# Altium project MCU.PrjPcb
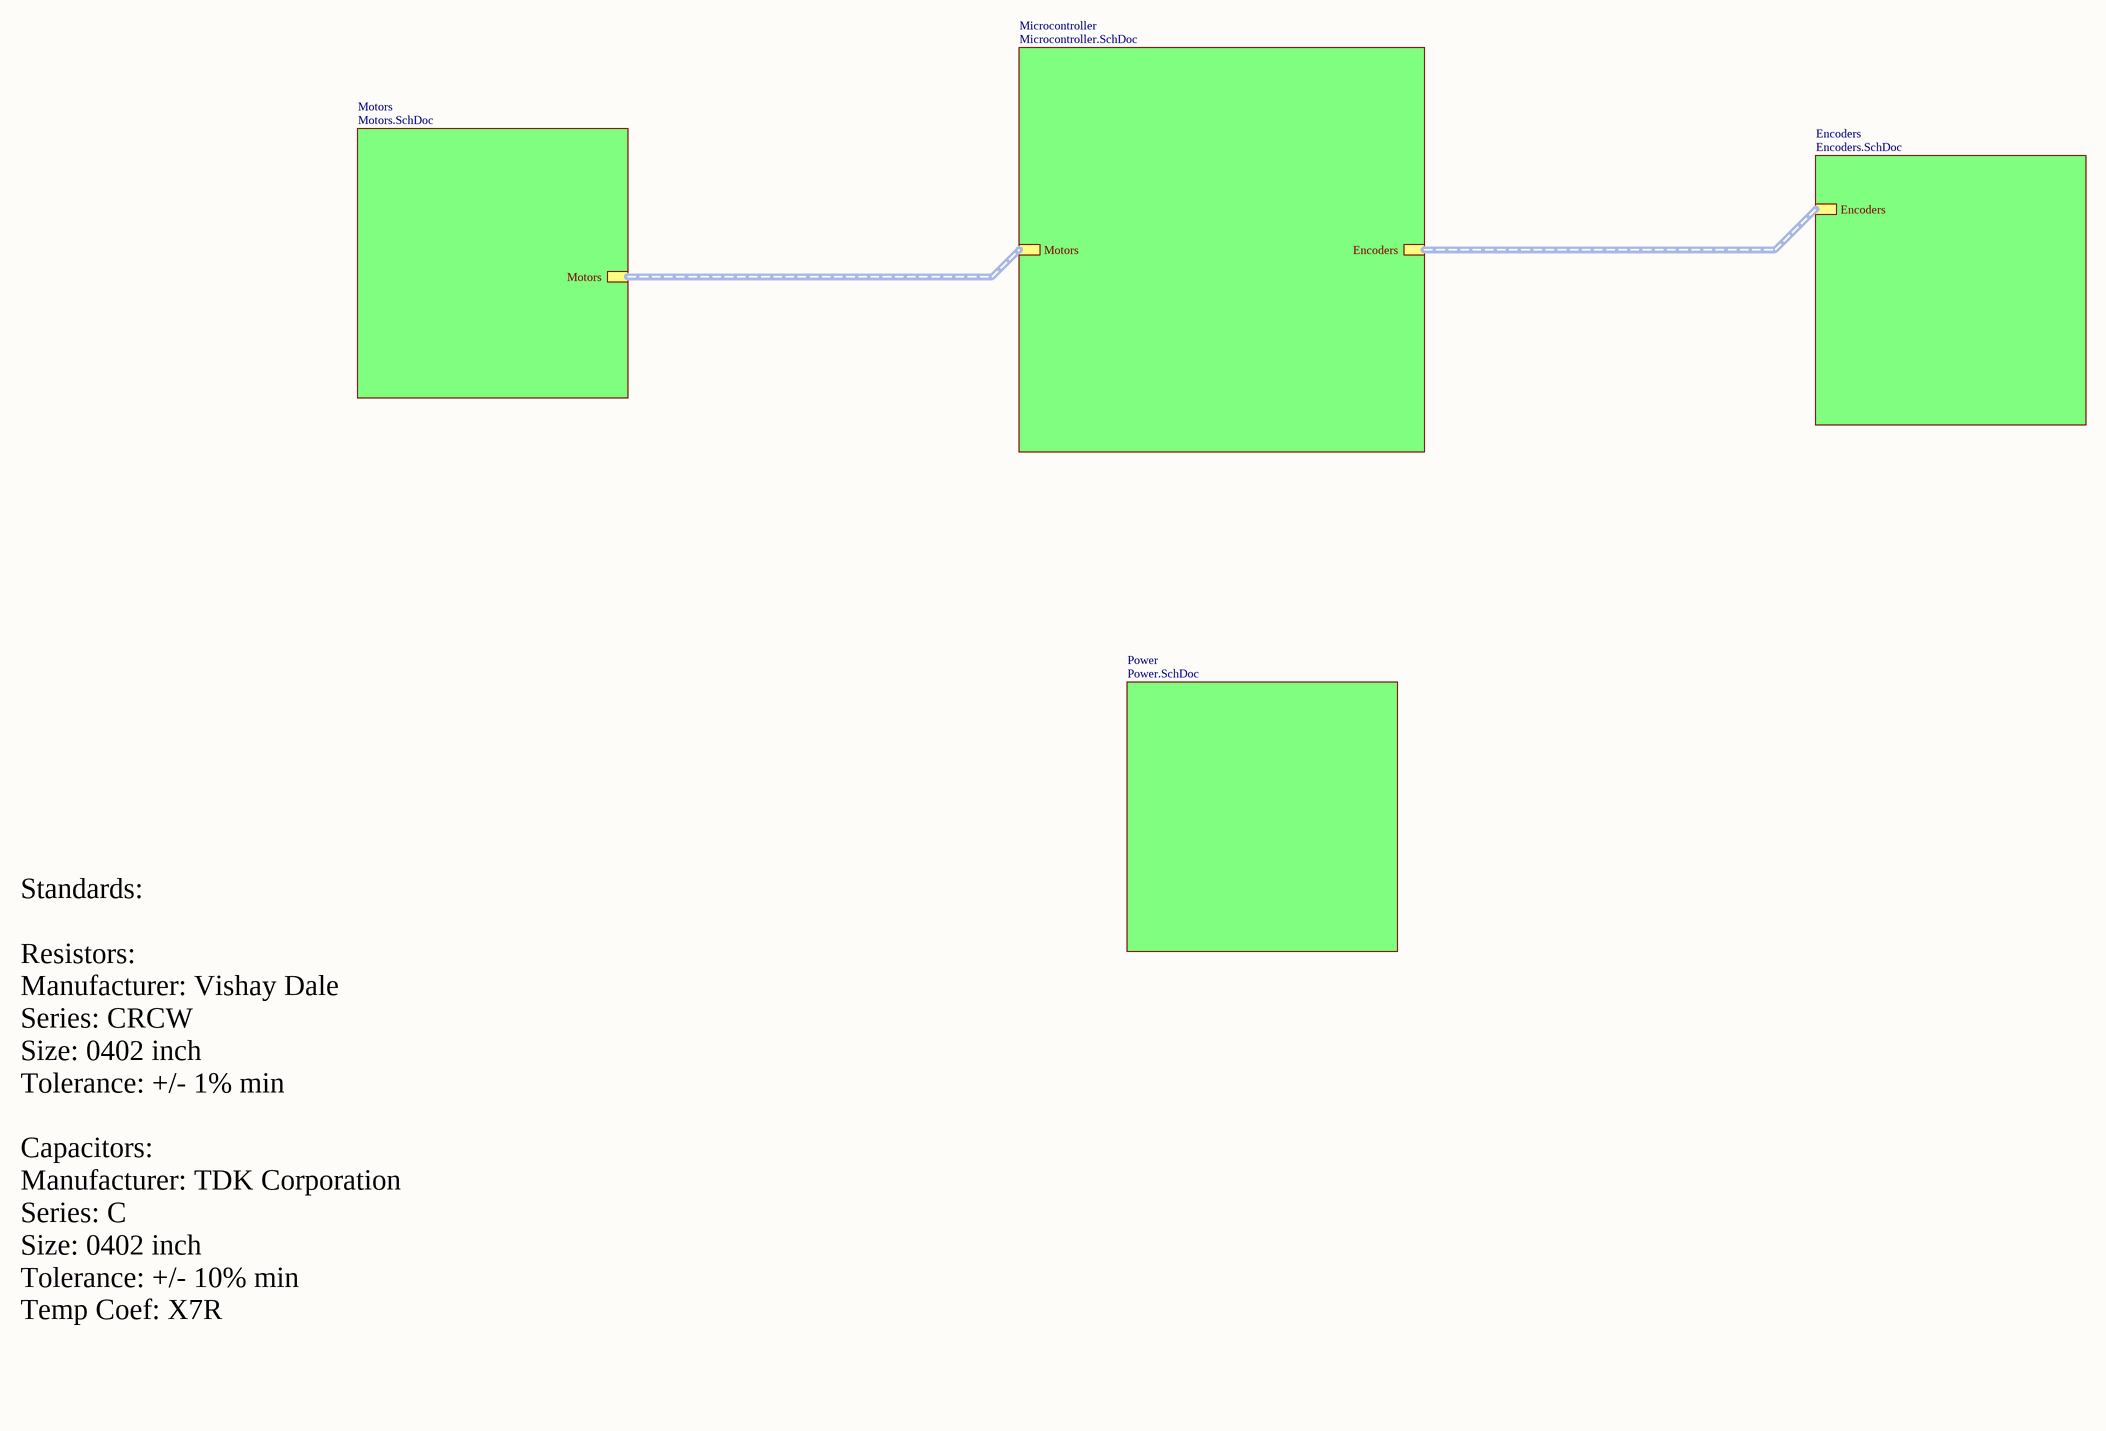
[diagram p0: Cover.SchDoc]
5 sheets, 49 parts. Net scope: hierarchical (ports join the sheet entries above them; power ports are global).
Board file: MCU.PcbDoc
Sheets:
  Cover.SchDoc
    Microcontroller = Microcontroller.SchDoc
    Encoders = Encoders.SchDoc
    Power = Power.SchDoc
    Motors = Motors.SchDoc

## Sheet Cover.SchDoc
size OrCAD C

### Sub-sheets
Encoders = Encoders.SchDoc: Encoders (harness Encoders)
Microcontroller = Microcontroller.SchDoc: Motors (harness Motors), Encoders (harness Encoders)
Motors = Motors.SchDoc: Motors (harness Motors)
Power = Power.SchDoc: no entries

### Buses and harness runs
harness sheet Encoders/Encoders = sheet Microcontroller/Encoders
harness sheet Microcontroller/Motors = sheet Motors/Motors

### Notes on the sheet
- Standards:
  Resistors:
  Manufacturer: Vishay Dale
  Series: CRCW
  Size: 0402 inch
  Tolerance: +/- 1% min
  Capacitors:
  Manufacturer: TDK Corporation
  Series: C
  Size: 0402 inch
  Tolerance: +/- 10% min
  Temp Coef: X7R

## Sheet Microcontroller.SchDoc
size OrCAD C
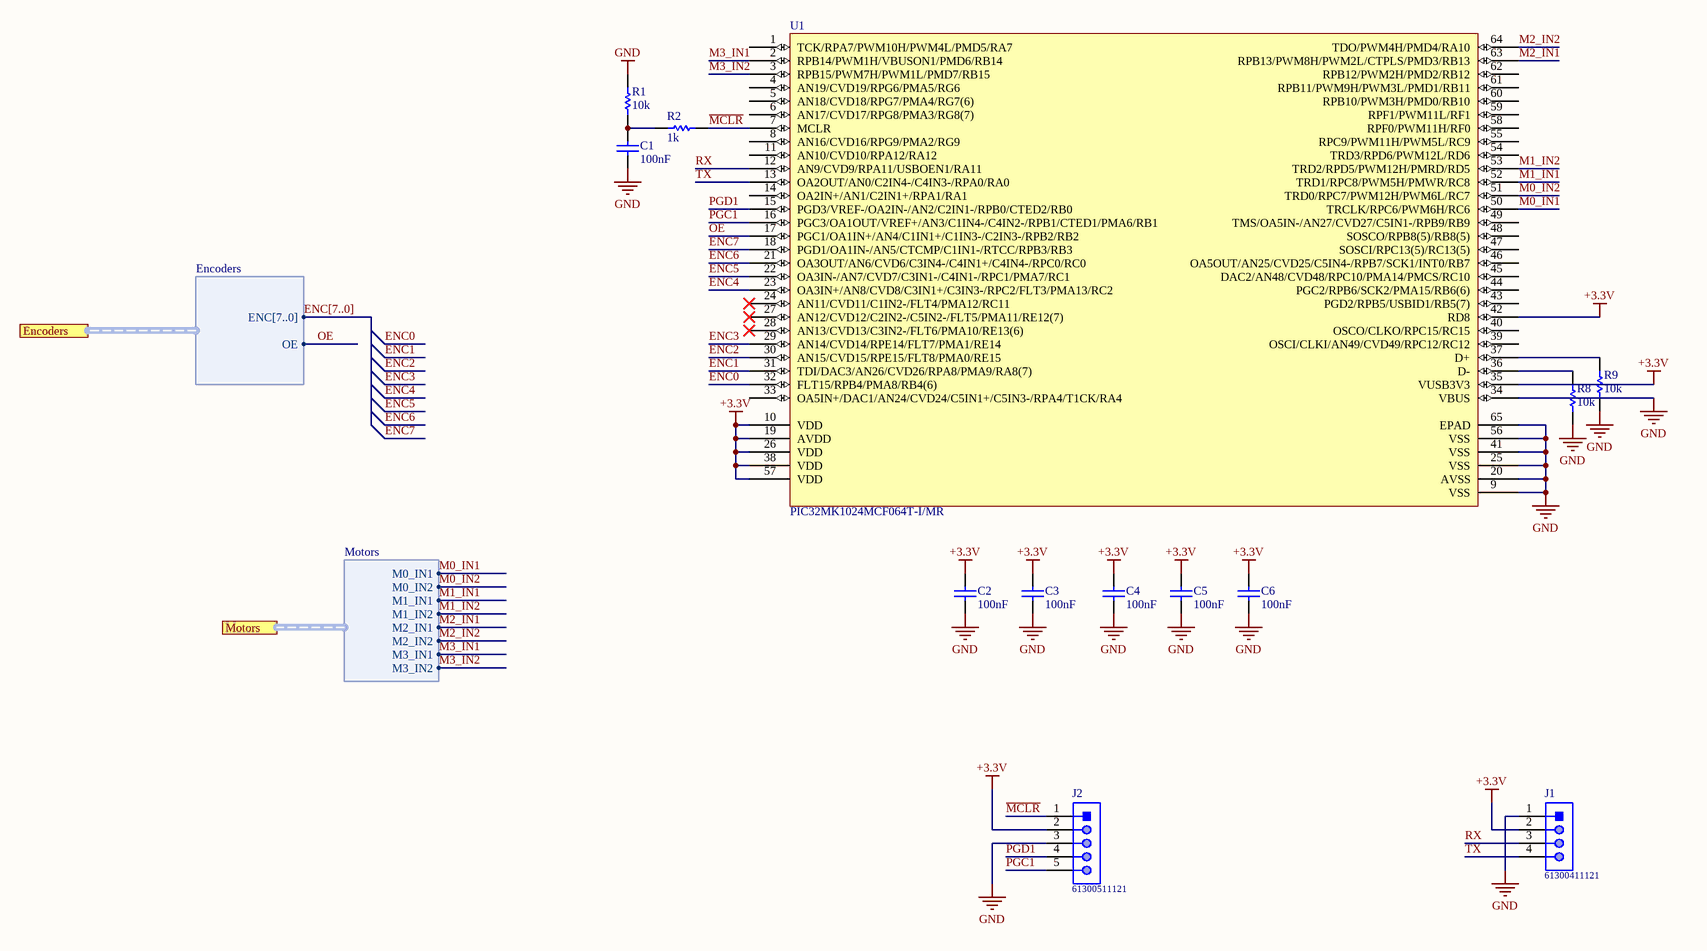
[diagram p1: Microcontroller.SchDoc]

### Parts
C1  100nF  [0402]
C2  100nF  [0402]
C3  100nF  [0402]
C4  100nF  [0402]
C5  100nF  [0402]
C6  100nF  [0402]
J1  61300411121  [61300411121]
J2  61300511121  [61300511121]
R1  10k  [0402]
R2  1k  [0402]
R8  10k  [0402]
R9  10k  [0402]
U1  PIC32MK1024MCF064T-I/MR  [64-TQFP]

### Ports
Encoders (harness Encoders), Motors (harness Motors)

### Harnesses
Motors: M0_IN1, M0_IN2, M1_IN1, M1_IN2, M2_IN1, M2_IN2, M3_IN1, M3_IN2
Encoders: ENC[7..0], OE

### Nets
+3.3V: C2.2 C3.2 C4.2 C5.2 C6.2 J1.2 J2.2 U1.10(VDD) U1.19(AVDD) U1.26(VDD) U1.35(VUSB3V3) U1.38(VDD) U1.42(RD8) U1.57(VDD)
GND: C1.1 C2.1 C3.1 C4.1 C5.1 C6.1 J1.1 J2.3 R1.2 R8.1 R9.1 U1.9(VSS) U1.20(AVSS) U1.25(VSS) U1.34(VBUS) U1.41(VSS) U1.56(VSS) U1.65(EPAD)
ENC0: U1.32(FLT15/RPB4/PMA8/RB4(6))
ENC1: U1.31(TDI/DAC3/AN26/CVD26/RPA8/PMA9/RA8(7))
ENC2: U1.30(AN15/CVD15/RPE15/FLT8/PMA0/RE15)
ENC3: U1.29(AN14/CVD14/RPE14/FLT7/PMA1/RE14)
ENC4: U1.23(OA3IN+/AN8/CVD8/C3IN1+/C3IN3-/RPC2/FLT3/PMA13/RC2)
ENC5: U1.22(OA3IN-/AN7/CVD7/C3IN1-/C4IN1-/RPC1/PMA7/RC1)
ENC6: U1.21(OA3OUT/AN6/CVD6/C3IN4-/C4IN1+/C4IN4-/RPC0/RC0)
ENC7: U1.18(PGD1/OA1IN-/AN5/CTCMP/C1IN1-/RTCC/RPB3/RB3)
M0_IN1: U1.50(TRCLK/RPC6/PWM6H/RC6) ; port Motors.M0_IN1
M0_IN2: U1.51(TRD0/RPC7/PWM12H/PWM6L/RC7) ; port Motors.M0_IN2
M1_IN1: U1.52(TRD1/RPC8/PWM5H/PMWR/RC8) ; port Motors.M1_IN1
M1_IN2: U1.53(TRD2/RPD5/PWM12H/PMRD/RD5) ; port Motors.M1_IN2
M2_IN1: U1.63(RPB13/PWM8H/PWM2L/CTPLS/PMD3/RB13) ; port Motors.M2_IN1
M2_IN2: U1.64(TDO/PWM4H/PMD4/RA10) ; port Motors.M2_IN2
M3_IN1: U1.2(RPB14/PWM1H/VBUSON1/PMD6/RB14) ; port Motors.M3_IN1
M3_IN2: U1.3(RPB15/PWM7H/PWM1L/PMD7/RB15) ; port Motors.M3_IN2
~{MCLR}: J2.1 R2.2 U1.7(MCLR)
OE: U1.17(PGC1/OA1IN+/AN4/C1IN1+/C1IN3-/C2IN3-/RPB2/RB2) ; port Encoders.OE
PGC1: J2.5 U1.16(PGC3/OA1OUT/VREF+/AN3/C1IN4-/C4IN2-/RPB1/CTED1/PMA6/RB1)
PGD1: J2.4 U1.15(PGD3/VREF-/OA2IN-/AN2/C2IN1-/RPB0/CTED2/RB0)
RX: J1.3 U1.12(AN9/CVD9/RPA11/USBOEN1/RA11)
TX: J1.4 U1.13(OA2OUT/AN0/C2IN4-/C4IN3-/RPA0/RA0)
NetC1_2: C1.2 R1.1 R2.1
NetR8_2: R8.2 U1.36(D-)
NetR9_2: R9.2 U1.37(D+)

Not connected (* = marked no-connect by the designer): U1 1(TCK/RPA7/PWM10H/PWM4L/PMD5/RA7) 4(AN19/CVD19/RPG6/PMA5/RG6) 5(AN18/CVD18/RPG7/PMA4/RG7(6)) 6(AN17/CVD17/RPG8/PMA3/RG8(7)) 8(AN16/CVD16/RPG9/PMA2/RG9) 11(AN10/CVD10/RPA12/RA12) 14(OA2IN+/AN1/C2IN1+/RPA1/RA1) 24(AN11/CVD11/C1IN2-/FLT4/PMA12/RC11)* 27(AN12/CVD12/C2IN2-/C5IN2-/FLT5/PMA11/RE12(7))* 28(AN13/CVD13/C3IN2-/FLT6/PMA10/RE13(6))* 33(OA5IN+/DAC1/AN24/CVD24/C5IN1+/C5IN3-/RPA4/T1CK/RA4) 39(OSCI/CLKI/AN49/CVD49/RPC12/RC12) 40(OSCO/CLKO/RPC15/RC15) 43(PGD2/RPB5/USBID1/RB5(7)) 44(PGC2/RPB6/SCK2/PMA15/RB6(6)) 45(DAC2/AN48/CVD48/RPC10/PMA14/PMCS/RC10) 46(OA5OUT/AN25/CVD25/C5IN4-/RPB7/SCK1/INT0/RB7) 47(SOSCI/RPC13(5)/RC13(5)) 48(SOSCO/RPB8(5)/RB8(5)) 49(TMS/OA5IN-/AN27/CVD27/C5IN1-/RPB9/RB9) 54(TRD3/RPD6/PWM12L/RD6) 55(RPC9/PWM11H/PWM5L/RC9) 58(RPF0/PWM11H/RF0) 59(RPF1/PWM11L/RF1) 60(RPB10/PWM3H/PMD0/RB10) 61(RPB11/PWM9H/PWM3L/PMD1/RB11) 62(RPB12/PWM2H/PMD2/RB12)

### Buses and harness runs
bus ENC[7..0]

### Library data of the parts
C1-C6 = C1005X7R1C104K050BC: TDK - C1005X7R1C104K050BC. - CERAMIC CAPACITOR, 0.1UF, 16V, X7R, 10%, 0402, FULL REEL; Part Name: C1005X7R1C104K050BC; Supplier 1: Digi-Key; Supplier Part Number 1: 445-4952-1-ND; Manufacturer: TDK; Manufacturer Part Number: C1005X7R1C104K050BC; RoHS: Yes; Category: Ceramic Capacitors; Stock 1: 2957810; Pricing 1: 1=0.10000, 10=0.07500, 100=0.03350, 500=0.02390, 1000=0.01879, 2500=0.01708, 5000=0.01571 (USD); Mount: Surface Mount; Case/Package: 0402; Min Operating Temperature: -55°C; Max Operating Temperature: 125°C; Termination: SMD/SMT; Voltage: 16V; Tolerance: 10%; Capacitance: 100nF; Packaging: Tape and Reel; Voltage Rating: 16V; Package Quantity: 1; Voltage Rating (DC): 16V; Length: 1mm; Height: 0.5mm; Radiation Hardening: No; REACH SVHC: Unknown; Number of Pins: 2; Weight: 2.3E-05oz; Case Code (Metric): 1005; Case Code (Imperial): 0402; Dielectric Material: Ceramic; Dielectric: X7R; Composition: Ceramic; Depth: 0.5mm; Thickness: 0.022inch; Width: 0.02inch; Lead Free: Lead Free
J1 = CMP-1502-01064-1: THT Vertical Pin Header WR-PHD, Pitch 2.54 mm, Single Row, 4 pins; Manufacturer: Wurth Elektronik; Withstanding Voltage: 500VAC; Rated Current: 3A; Working Voltage: 250VAC; Pin Number: 4; Gender: Male; Contact Resistance: 20mOhm; Pitch: 2.54mm; Manufacturer URL: http://www.we-online.de; Operating Temperature: -40to105degC; Packaging: Bag; Mounting Technology: THT; Package Reference: 61300411121; Datasheet URL: https://katalog.we-online.de/em/datasheet/6130xx11121.pdf; Publisher: WurthElektronik; Part Number: 61300411121; Row Number: Single; Orientation: Vertical
J2 = CMP-1502-01068-1: THT Vertical Pin Header WR-PHD, Pitch 2.54 mm, Single Row, 5 pins; Manufacturer: Wurth Elektronik; Pin Number: 5; Contact Resistance: 20mOhm; Working Voltage: 250VAC; Pitch: 2.54mm; Withstanding Voltage: 500VAC; Rated Current: 3A; Gender: Male; Datasheet URL: https://katalog.we-online.de/em/datasheet/6130xx11121.pdf; Orientation: Vertical; Mounting Technology: THT; Row Number: Single; Package Reference: 61300511121; Publisher: WurthElektronik; Part Number: 61300511121; Packaging: Bag; Manufacturer URL: http://www.we-online.de; Operating Temperature: -40to105degC
R1 R8 R9 = CRCW040210K0FKEDC: D10/CRCW0402-C 100 10K 1% ET7; Manufacturer: Vishay; Power Rating: 62.5mW; Temperature Coefficient: 100ppm/°C; Part Name: CRCW040210K0FKEDC; Supplier 1: Digi-Key; Supplier Part Number 1: 541-3959-6-ND; Manufacturer Part Number: CRCW040210K0FKEDC; RoHS: Yes; Category: Resistors; Stock 1: 3541307; Pricing 1: 1=0.10000, 10=0.03200, 100=0.01300, 1000=0.00583, 2500=0.00506, 5000=0.00418 (USD); Case/Package: Molded; Contact Plating: Tin; Min Operating Temperature: -55°C; Max Operating Temperature: 155°C; Tolerance: 1%; Termination: Wraparound; Resistance: 10k; Composition: Thick Film; Length: 1mm; Lead Free: Lead Free
R2 = CRCW04021K00FKED: Res Thick Film 0402 1K Ohm 1% 1/16W ±100ppm/°C Molded SMD Paper T/R; Manufacturer: Vishay Dale; Part Name: CRCW04021K00FKED; Supplier 1: Digi-Key; Supplier Part Number 1: 541-1.00KLDKR-ND; Manufacturer Part Number: CRCW04021K00FKED; RoHS: Yes; Category: Chip SMD Resistors; Stock 1: 767306; Pricing 1: 1=0.10000, 10=0.03600, 100=0.01460, 1000=0.00657, 2500=0.00570, 5000=0.00471 (USD); Tolerance: 1%; Resistance: 1k
U1 = PIC32MK1024MCF064-I/PT: IC MCU 32BIT 1MB FLASH 64TQFP; Manufacturer: Microchip; Part Name: PIC32MK1024MCF064-I/PT; Supplier 1: Digi-Key; Supplier Part Number 1: PIC32MK1024MCF064-I/PT-ND; Manufacturer Part Number: PIC32MK1024MCF064-I/PT; RoHS: No; Category: Microcontrollers; Stock 1: 2; Pricing 1: 1=7.30000, 25=6.70000, 100=6.06000 (USD); ComponentLink1URL: http://www.farnell.com/datasheets/2302007.pdf?src-supplier=Farnell; ComponentLink1Description: http://www.farnell.com/datasheets/2302007.pdf?src-supplier=Farnell; ComponentLink2URL: http://www.microchip.com/mymicrochip/filehandler.aspx?ddocname=en597535&src-supplier=Digi-Key; ComponentLink2Description: http://www.microchip.com/mymicrochip/filehandler.aspx?ddocname=en597535&src-supplier=Digi-Key

## Sheet Encoders.SchDoc
size OrCAD C
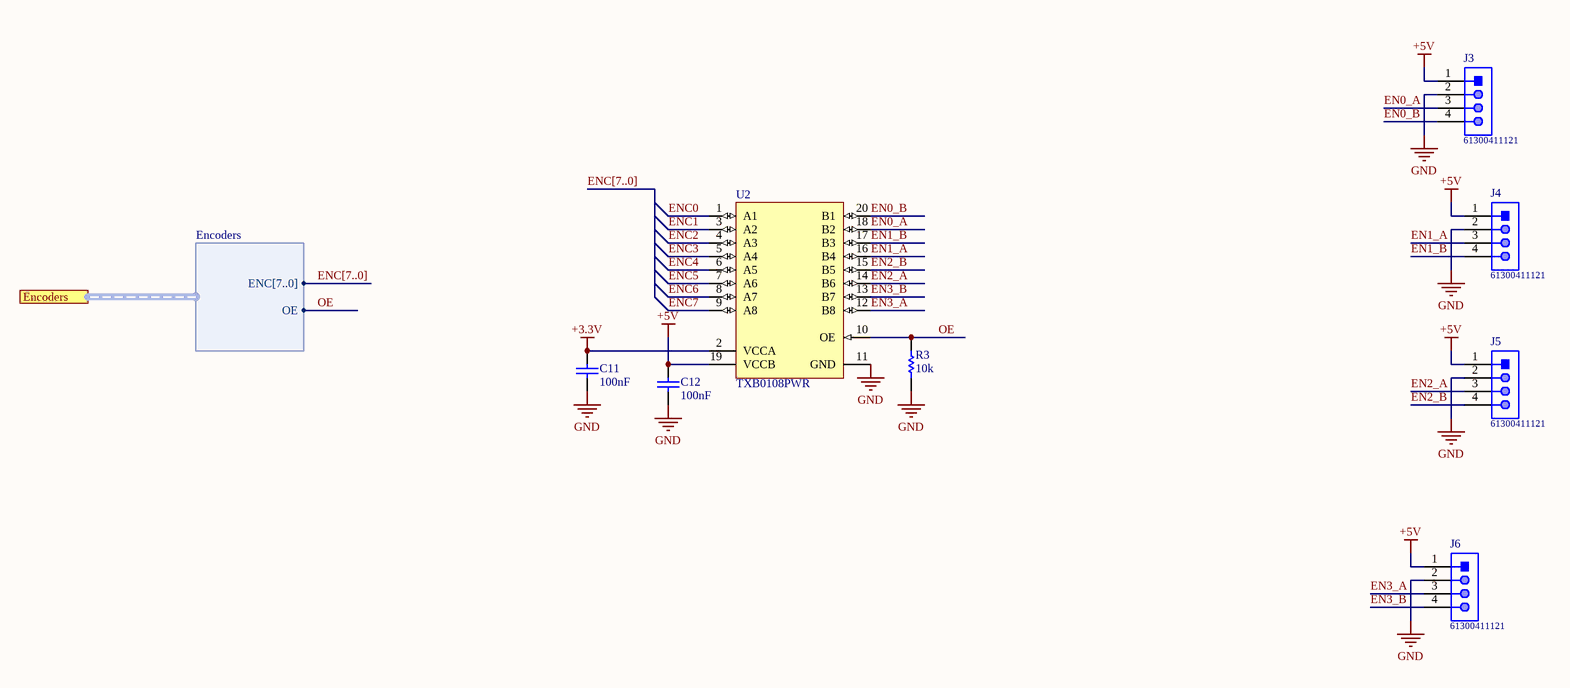
[diagram p2: Encoders.SchDoc]

### Parts
C11  100nF  [0402]
C12  100nF  [0402]
J3  61300411121  [61300411121]
J4  61300411121  [61300411121]
J5  61300411121  [61300411121]
J6  61300411121  [61300411121]
R3  10k  [0402]
U2  TXB0108PWR  [PW0020A_L]

### Ports
Encoders (harness Encoders)

### Harnesses
Encoders: ENC[7..0], OE

### Nets
+3.3V: C11.2 U2.2(VCCA)
+5V: C12.2 J3.1 J4.1 J5.1 J6.1 U2.19(VCCB)
GND: C11.1 C12.1 J3.2 J4.2 J5.2 J6.2 R3.1 U2.11(GND)
EN0_A: J3.3 U2.18(B2)
EN0_B: J3.4 U2.20(B1)
EN1_A: J4.3 U2.16(B4)
EN1_B: J4.4 U2.17(B3)
EN2_A: J5.3 U2.14(B6)
EN2_B: J5.4 U2.15(B5)
EN3_A: J6.3 U2.12(B8)
EN3_B: J6.4 U2.13(B7)
ENC0: U2.1(A1)
ENC1: U2.3(A2)
ENC2: U2.4(A3)
ENC3: U2.5(A4)
ENC4: U2.6(A5)
ENC5: U2.7(A6)
ENC6: U2.8(A7)
ENC7: U2.9(A8)
OE: R3.2 U2.10(OE) ; port Encoders.OE

### Buses and harness runs
bus ENC[7..0]

### Library data of the parts
C11 C12 = C1005X7R1C104K050BC: as C1 on sheet Microcontroller; Part Name: C1005X7R1C104K050BC; Supplier 1: Digi-Key; Supplier Part Number 1: 445-4952-1-ND; Manufacturer: TDK; Manufacturer Part Number: C1005X7R1C104K050BC; RoHS: Yes; Category: Ceramic Capacitors; Stock 1: 2957810; Pricing 1: 1=0.10000, 10=0.07500, 100=0.03350, 500=0.02390, 1000=0.01879, 2500=0.01708, 5000=0.01571 (USD); Mount: Surface Mount; Case/Package: 0402; Min Operating Temperature: -55°C; Max Operating Temperature: 125°C; Termination: SMD/SMT; Voltage: 16V; Tolerance: 10%; Capacitance: 100nF; Packaging: Tape and Reel; Voltage Rating: 16V; Package Quantity: 1; Voltage Rating (DC): 16V; Length: 1mm; Height: 0.5mm; Radiation Hardening: No; REACH SVHC: Unknown; Number of Pins: 2; Weight: 2.3E-05oz; Case Code (Metric): 1005; Case Code (Imperial): 0402; Dielectric Material: Ceramic; Dielectric: X7R; Composition: Ceramic; Depth: 0.5mm; Thickness: 0.022inch; Width: 0.02inch; Lead Free: Lead Free
J3-J6 = CMP-1502-01064-1: as J1 on sheet Microcontroller; Manufacturer URL: http://www.we-online.de; Operating Temperature: -40to105degC; Packaging: Bag; Mounting Technology: THT; Package Reference: 61300411121; Datasheet URL: https://katalog.we-online.de/em/datasheet/6130xx11121.pdf; Publisher: WurthElektronik; Part Number: 61300411121; Row Number: Single; Orientation: Vertical
R3 = CRCW040210K0FKEDC: as R1 on sheet Microcontroller; Part Name: CRCW040210K0FKEDC; Supplier 1: Digi-Key; Supplier Part Number 1: 541-3959-6-ND; Manufacturer Part Number: CRCW040210K0FKEDC; RoHS: Yes; Category: Resistors; Stock 1: 3541307; Pricing 1: 1=0.10000, 10=0.03200, 100=0.01300, 1000=0.00583, 2500=0.00506, 5000=0.00418 (USD); Case/Package: Molded; Contact Plating: Tin; Min Operating Temperature: -55°C; Max Operating Temperature: 155°C; Tolerance: 1%; Termination: Wraparound; Resistance: 10k; Composition: Thick Film; Length: 1mm; Lead Free: Lead Free
U2 = CMP-2000-07337-1: TXB0108 8-Bit Bidirectional Voltage-Level Translator with Auto-Direction Sensing and / +/- 15-kV ESD Protection, 1.2 to 3.6 V, -40 to 85 degC, 20-Pin TSSOP (PW), Green (RoHS & no Sb/Br), Tape and Reel; Manufacturer: Texas Instruments; Propagation Delay (Max): 4ns; Logic Function: Translator,Bidirectional; Input Type: Logic; Package Version: 4040064-5/G, 02/2011; Voltage - Supply: 1.2V~3.6V,1.65V~5.5V; Data Rate: 100Mbps; Other Names: 296-21527-6; Number of Channels: 8; Differential - Input: Output:No/No; Number of Outputs/Channel: 1; Product Training Modules: VoltageLevelTranslation; Dynamic Catalog: TXBSeries; Package Reference: PW20; Package Description: 20-Pin Small Outline Package Integrated Circuit, Body 6.5 x 4.4 mm, Pitch 0.65 mm; Category: IntegratedCircuits(ICs); Datasheet URL: http://www.ti.com/general/docs/lit/getliterature.tsp?genericPartNumber=TXB0108&fileType=pdf; Package / Case: 20-TSSOP(0.173",4.40mmWidth); Family: Logic-Translators; Standard Package: 1; Series: -; Manufacturer URL: http://www.ti.com/; Number of Bits: 8; Package URL: http://www.ti.com/litv/pdf/mpds362; Output Type: Logic; Datasheet Version: Rev. F, 12/2014; Packaging: Digi-Reel®; Operating Temperature: -40°C~85°C; Supplier Device Package: 20-TSSOP; Mounting Technology: SurfaceMount

## Sheet Power.SchDoc
size OrCAD C
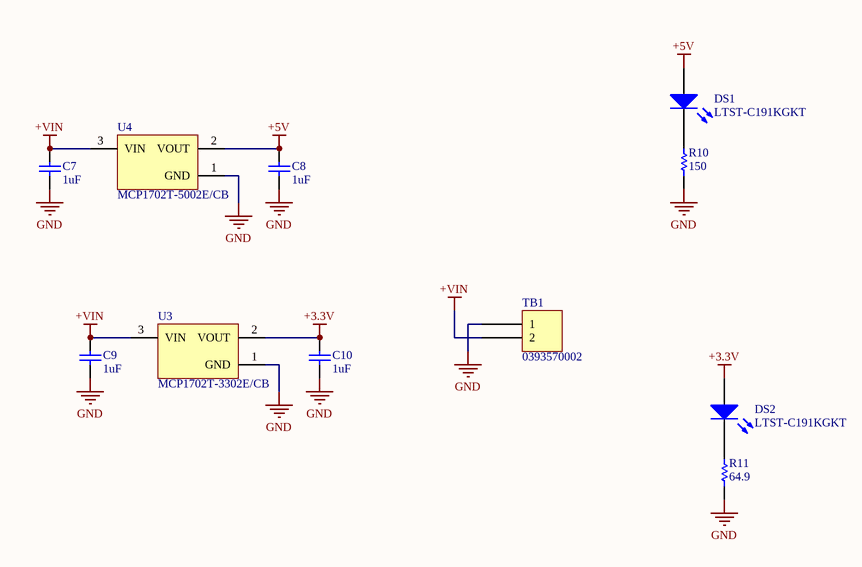
[diagram p3: Power.SchDoc]

### Parts
C7  1uF  [0603]
C8  1uF  [0603]
C9  1uF  [0603]
C10  1uF  [0603]
DS1  LTST-C191KGKT  [LITE-ON-LTST-C191KRKT-2_V]
DS2  LTST-C191KGKT  [LITE-ON-LTST-C191KRKT-2_V]
R10  150  [0402]
R11  64.9  [0402]
TB1  0393570002  [0393570002]
U3  MCP1702T-3302E/CB  [SOT-23A-CB3_N]
U4  MCP1702T-5002E/CB  [SOT-23A-CB3_N]

### Nets
+3.3V: C10.2 DS2.1(A) U3.2(VOUT)
+5V: C8.2 DS1.1(A) U4.2(VOUT)
+VIN: C7.2 C9.2 TB1.2 U3.3(VIN) U4.3(VIN)
GND: C7.1 C8.1 C9.1 C10.1 R10.1 R11.1 TB1.1 U3.1(GND) U4.1(GND)
NetDS1_2: DS1.2(K) R10.2
NetDS2_2: DS2.2(K) R11.2

### Library data of the parts
C7-C10 = C1608X7R1C105K080AC: TDK - C1608X7R1C105K080AC - SMD Multilayer Ceramic Capacitor, 1 µF, 16 V, 0603 [1608 Metric], ± 10%, X7R, C Series TDK; Voltage: 16V; Part Name: C1608X7R1C105K080AC; Supplier 1: Digi-Key; Supplier Part Number 1: 445-1604-1-ND; Manufacturer: TDK; Manufacturer Part Number: C1608X7R1C105K080AC; RoHS: Yes; Category: Ceramic Capacitors; Stock 1: 247756; Pricing 1: 1=0.15000, 10=0.10500, 100=0.04950, 500=0.03472, 1000=0.02875 (USD); Mount: Surface Mount; Case/Package: 0603; Min Operating Temperature: -55°C; Max Operating Temperature: 125°C; Termination: SMD/SMT; Tolerance: 10%; Capacitance: 1uF; Packaging: Tape and Reel; Voltage Rating: 16V; Package Quantity: 1; Voltage Rating (DC): 16V; Length: 1.6mm; Height: 0.8mm; Radiation Hardening: No; REACH SVHC: No SVHC; Weight: 7.1E-05oz; Case Code (Metric): 1608; Case Code (Imperial): 0603; Dielectric Material: Ceramic; Dielectric: X7R; Composition: Ceramic; Depth: 0.8mm; Thickness: 0.037inch; Width: 0.031inch; Lead Free: Lead Free
DS1 DS2 = CMP-2000-05198-1: Chip LED, Green, 574 nm, 40 pF, -55 to 85 degC, 2-Pin SMD, RoHS, Tape and Reel; Manufacturer: Lite-On; Rad Hardened: No; Emitting Color: YellowGreen; Product Height (mm): 0.55mm; Forward Voltage: 2.4V; Number of Elements: 1; Dominant Wave Length: 571nm; DELETED: Compliant; Viewing Angle: 130deg; High Brightness: Yes; Peak Wavelength: 574nm; Type: Uni-Color; Forward Current: 30mA; Product Length (mm): 1.6mm; Luminous Intensity: 35mcd; Test Current (It): 20mA; Chip Material: AlGaInP; Product Depth (mm): 0.8mm; Shape Type: Rectangular; Reverse Voltage: 5V; Power Dissipation: 75W; Pin Count: 2; Lens Dimensions: 1.1X0.8X0.37mm; Packaging: TapeandReel; Main Category: ChipLED; Operating Temperature Classification: Industrial; Package Type: ChipLed; Mounting: SurfaceMount; Lum Intensity: 35mcd; Operating Temp Range: -55Cto85C; Datasheet Version: Jan-07; Datasheet URL: http://download.siliconexpert.com/pdfs/2007/08/26/semi_b/manual/lot/ds/ltst-c191kgkt.pdf; Manufacturer URL: http://www.us.liteon.com/
R10 = CRCW0402150RFKED: Resistor;  Thick Film;  150 Ohms;  0.063 W;  1%;  SMT;  0402;  TCR 37 ppm/DegC; Manufacturer: Vishay; Part Name: CRCW0402150RFKED; Supplier 1: Newark; Supplier Part Number 1: 52K6721; Manufacturer Part Number: CRCW0402150RFKED; RoHS: Yes; Category: Chip SMD Resistors; Stock 1: 40000; Pricing 1: 1=0.10000, 25=0.03700, 100=0.01500, 250=0.01300, 500=0.01000, 1000=0.00700, 2500=0.00600, 5000=0.00400 (USD); Tolerance: 1%; Resistance: 150
R11 = CRCW040264R9FKED: VISHAY   CRCW040264R9FKED.   Surface Mount Chip Resistor, Thick Film, AEC-Q200 CRCW Series, 64.9 ohm, 63 mW,  1%, 50 V; Part Name: CRCW040264R9FKED; Supplier 1: Digi-Key; Supplier Part Number 1: 541-64.9LCT-ND; Manufacturer: Vishay; Manufacturer Part Number: CRCW040264R9FKED; RoHS: Yes; Category: Chip SMD Resistors; Stock 1: 11517; Pricing 1: 1=0.10000, 10=0.03600, 100=0.01460, 1000=0.00657, 2500=0.00570, 5000=0.00471 (USD); Case/Package: 0402; Tolerance: 1%; Resistance: 64.9
TB1 = 0393570002: Conn Eurostyle Block 2 POS 3.5mm Solder ST Thru-Hole 17.5A/Contact Eurostyle™; Manufacturer: Molex; Number of Contacts: 2; Max Voltage Rating (AC): 300V; Wire Gauge (Max): 28AWG; Wire Gauge (Min): 16AWG; Plating: Nickel; Number of Levels: 1; Current: 12A; Part Name: 0393570002; Supplier 1: Digi-Key; Supplier Part Number 1: WM7877-ND; Manufacturer Part Number: 0393570002; RoHS: Yes; Category: Terminal Blocks; Stock 1: 34753; Pricing 1: 1=1.15000, 10=0.71800, 25=0.61400, 50=0.55200, 100=0.54050, 250=0.46000, 500=0.43700, 1000=0.39100, 5000=0.30590 (USD); Mount: Through Hole; Contact Plating: Tin; Contact Material: Copper; Housing Color: Black; Housing Material: Polyamide; Min Operating Temperature: -40°C; Max Operating Temperature: 85°C; Packaging: Bulk; Number of Rows: 1; Termination: Solder; Orientation: Straight; Max Supply Voltage (AC): 300V; Length: 7mm; Pitch: 3.5mm; Depth: 7.29mm; ComponentLink1URL: https://datasheet.ciiva.com/6751/393590004-sd-6751377.pdf?src-supplier=Digi-Key; ComponentLink1Description: https://datasheet.ciiva.com/6751/393590004-sd-6751377.pdf?src-supplier=Digi-Key; Color: Black; Number of Positions Per Level: 2; Voltage: 300V; Radiation Hardening: No
U3 = CMP-0136-00799-1: 250 mA Low Quiescent Current LDO Regulator, 3-Pin SOT-23A, Extended Temperature, Tape and Reel; DatasheetVersion: revD, Jun-2009; PackageVersion: revBB, Aug-2009; PackageReference: SOT-23A-CB3; PackageDescription: 3-Lead Plastic Small Outline Transistor (CB) [SOT-23A]
U4 = CMP-0136-00808-1: 250 mA Low Quiescent Current LDO Regulator, 3-Pin SOT-23A, Extended Temperature, Tape and Reel; PackageDescription: 3-Lead Plastic Small Outline Transistor (CB) [SOT-23A]; PackageReference: SOT-23A-CB3; PackageVersion: revBB, Aug-2009; DatasheetVersion: revD, Jun-2009

## Sheet Motors.SchDoc
size OrCAD C
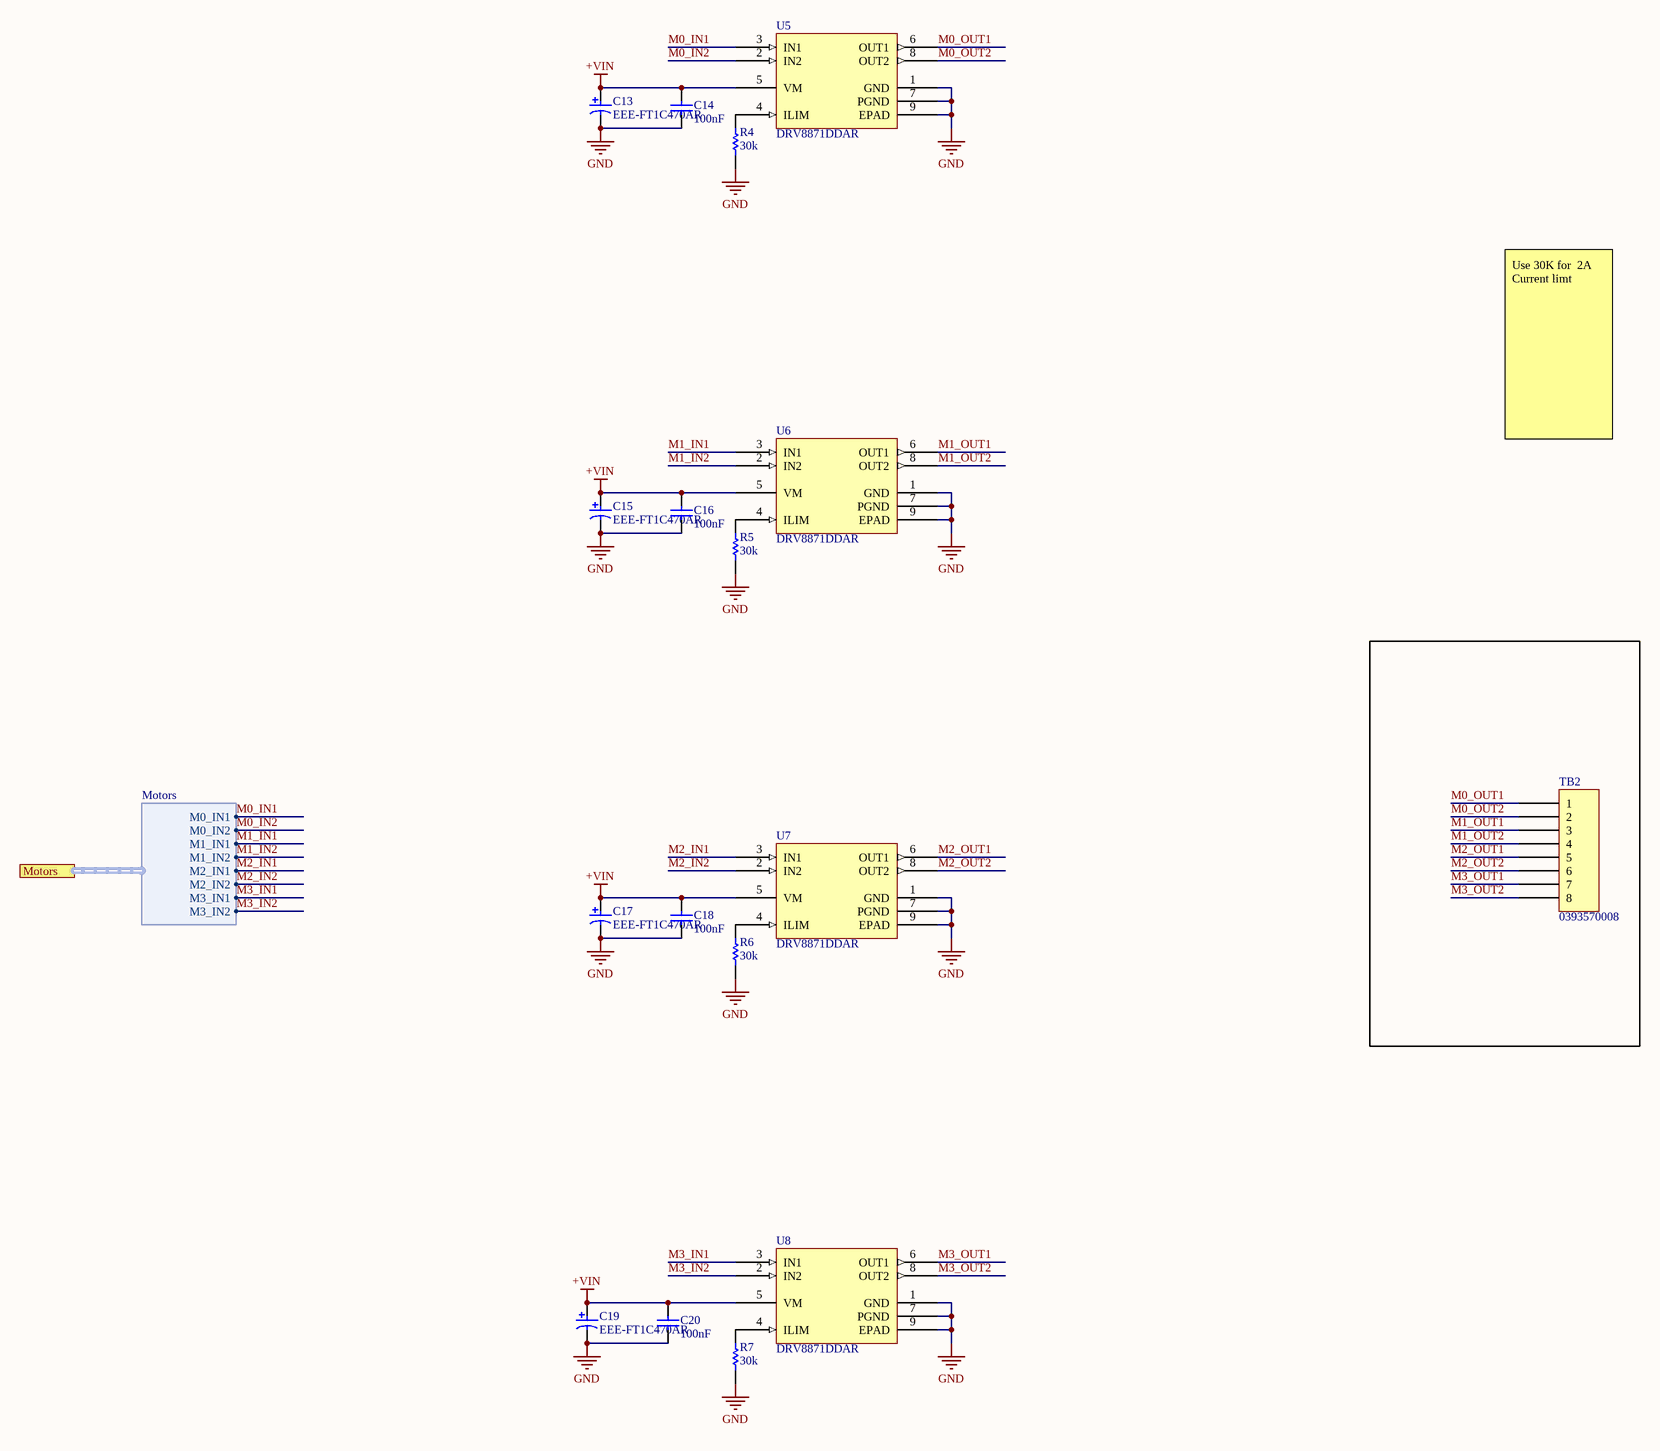
[diagram p4: Motors.SchDoc]

### Parts
C13  EEE-FT1C470AR  [EEE-FT1C470AR]
C14  100nF  [0402]
C15  EEE-FT1C470AR  [EEE-FT1C470AR]
C16  100nF  [0402]
C17  EEE-FT1C470AR  [EEE-FT1C470AR]
C18  100nF  [0402]
C19  EEE-FT1C470AR  [EEE-FT1C470AR]
C20  100nF  [0402]
R4  30k  [0402]
R5  30k  [0402]
R6  30k  [0402]
R7  30k  [0402]
TB2  0393570008  [0393570008]
U5  DRV8871DDAR  [8-HSOP]
U6  DRV8871DDAR  [8-HSOP]
U7  DRV8871DDAR  [8-HSOP]
U8  DRV8871DDAR  [8-HSOP]

### Ports
Motors (harness Motors)

### Harnesses
Motors: M0_IN1, M0_IN2, M1_IN1, M1_IN2, M2_IN1, M2_IN2, M3_IN1, M3_IN2

### Nets
+VIN: C13.1 C14.2 C15.1 C16.2 C17.1 C18.2 C19.1 C20.2 U5.5(VM) U6.5(VM) U7.5(VM) U8.5(VM)
GND: C13.2 C14.1 C15.2 C16.1 C17.2 C18.1 C19.2 C20.1 R4.1 R5.1 R6.1 R7.1 U5.1(GND) U5.7(PGND) U5.9(EPAD) U6.1(GND) U6.7(PGND) U6.9(EPAD) U7.1(GND) U7.7(PGND) U7.9(EPAD) U8.1(GND) U8.7(PGND) U8.9(EPAD)
M0_IN1: U5.3(IN1) ; port Motors.M0_IN1
M0_IN2: U5.2(IN2) ; port Motors.M0_IN2
M0_OUT1: TB2.1 U5.6(OUT1)
M0_OUT2: TB2.2 U5.8(OUT2)
M1_IN1: U6.3(IN1) ; port Motors.M1_IN1
M1_IN2: U6.2(IN2) ; port Motors.M1_IN2
M1_OUT1: TB2.3 U6.6(OUT1)
M1_OUT2: TB2.4 U6.8(OUT2)
M2_IN1: U7.3(IN1) ; port Motors.M2_IN1
M2_IN2: U7.2(IN2) ; port Motors.M2_IN2
M2_OUT1: TB2.5 U7.6(OUT1)
M2_OUT2: TB2.6 U7.8(OUT2)
M3_IN1: U8.3(IN1) ; port Motors.M3_IN1
M3_IN2: U8.2(IN2) ; port Motors.M3_IN2
M3_OUT1: TB2.7 U8.6(OUT1)
M3_OUT2: TB2.8 U8.8(OUT2)
NetR4_2: R4.2 U5.4(ILIM)
NetR5_2: R5.2 U6.4(ILIM)
NetR6_2: R6.2 U7.4(ILIM)
NetR7_2: R7.2 U8.4(ILIM)

### Notes on the sheet
- Use 30K for  2A Current limt

### Library data of the parts
C13 C15 C17 C19 = EEE-FT1C470AR: PANASONIC - EEEFT1C470AR - SMD Aluminium Electrolytic Capacitor, Radial Can - SMD, 47 µF, 16 V, 0.85 ohm, FT Series; Polarity: Polar; Voltage: 16V; Leakage Current: 7.5uA; Life (Hours): 2000Hour; Tolerance: 20%; Capacitance: 47uF; Ripple Current: 160mA; ESR (Equivalent Series Resistance): 850mR; Lead Diameter: 0.65mm; Part Name: EEE-FT1C470AR; Supplier 1: Digi-Key; Supplier Part Number 1: P15090CT-ND; Manufacturer: Panasonic; Manufacturer Part Number: EEEFT1C470AR; RoHS: Yes; Category: Aluminum Electrolytic Capacitors; Stock 1: 48806; Pricing 1: 1=0.42000, 10=0.29800, 100=0.19590, 500=0.14514, 1000=0.12337 (USD); Mount: Surface Mount; Case/Package: Radial; Contact Plating: Tin; Min Operating Temperature: -55°C; Max Operating Temperature: 105°C; Termination: SMD/SMT; Packaging: Tape and Reel; Voltage Rating: 16V; Ripple Current (AC): 160mA; Package Quantity: 2000; Voltage Rating (DC): 16V; Diameter: 4mm; Length: 5.8mm; Height: 5.8mm; Lead Pitch: 1mm; Height - Seated (Max): 0.24inch; Radiation Hardening: No; REACH SVHC: No SVHC
C14 C16 C18 C20 = C1005X7R1C104K050BC: as C1 on sheet Microcontroller; Part Name: C1005X7R1C104K050BC; Supplier 1: Digi-Key; Supplier Part Number 1: 445-4952-1-ND; Manufacturer: TDK; Manufacturer Part Number: C1005X7R1C104K050BC; RoHS: Yes; Category: Ceramic Capacitors; Stock 1: 2957810; Pricing 1: 1=0.10000, 10=0.07500, 100=0.03350, 500=0.02390, 1000=0.01879, 2500=0.01708, 5000=0.01571 (USD); Mount: Surface Mount; Case/Package: 0402; Min Operating Temperature: -55°C; Max Operating Temperature: 125°C; Termination: SMD/SMT; Voltage: 16V; Tolerance: 10%; Capacitance: 100nF; Packaging: Tape and Reel; Voltage Rating: 16V; Package Quantity: 1; Voltage Rating (DC): 16V; Length: 1mm; Height: 0.5mm; Radiation Hardening: No; REACH SVHC: Unknown; Number of Pins: 2; Weight: 2.3E-05oz; Case Code (Metric): 1005; Case Code (Imperial): 0402; Dielectric Material: Ceramic; Dielectric: X7R; Composition: Ceramic; Depth: 0.5mm; Thickness: 0.022inch; Width: 0.02inch; Lead Free: Lead Free
R4-R7 = CRCW040230K0FKED: Res Thick Film 0402 30K Ohm 1% 0.063W(1/16W) ±100ppm/C Molded SMD Automotive Paper T/R; Manufacturer: Vishay; Power Rating: 63mW; Temperature Coefficient: 100ppm/°C; Voltage Rating: 50V; Part Name: CRCW040230K0FKED; Supplier 1: Digi-Key; Supplier Part Number 1: 541-30.0KLCT-ND; Manufacturer Part Number: CRCW040230K0FKED; RoHS: Yes; Category: Chip SMD Resistors; Stock 1: 3845; Pricing 1: 1=0.10000, 10=0.03600, 100=0.01460, 1000=0.00657, 2500=0.00570, 5000=0.00471 (USD); Case/Package: 0402; Weight: 2.3E-05oz; Case Code (Metric): 1005; Case Code (Imperial): 0402; Contact Plating: Tin; Min Operating Temperature: -55°C; Max Operating Temperature: 155°C; Packaging: Tape and Reel; Tolerance: 1%; Termination: SMD/SMT; Package Quantity: 10000; Resistance: 30k; Military Standard: Not; Composition: Thick Film; Max Power Dissipation: 63mW; Number of Terminations: 2; Voltage Rating (DC): 50V; Length: 1mm; Height: 0.35mm; Width: 0.5mm; Depth: 0.5mm; Radiation Hardening: No; Lead Free: Lead Free
TB2 = 0393570008: Conn Eurostyle Block 8 POS 3.5mm Solder ST Thru-Hole 17.5A/Contact; Manufacturer: Molex; Number of Contacts: 8; Max Voltage Rating (AC): 300V; Wire Gauge (Max): 28AWG; Wire Gauge (Min): 16AWG; Plating: Nickel; Number of Levels: 1; Current: 12A; Part Name: 0393570008; Supplier 1: Digi-Key; Supplier Part Number 1: 23-0393570008-ND; Manufacturer Part Number: 0393570008; RoHS: Yes; Category: Terminal Blocks; Stock 1: 351; Pricing 1: 1=3.02000, 10=2.29800, 25=2.15280, 50=1.91360, 100=1.87200, 250=1.72640, 500=1.56000, 1000=1.38320, 5000=1.30000 (USD); Mount: Through Hole; Contact Plating: Tin; Contact Material: Copper; Housing Color: Black; Housing Material: Polyamide; Min Operating Temperature: -30°C; Max Operating Temperature: 85°C; Packaging: Bulk; Number of Rows: 1; Termination: Solder; Orientation: Straight; Max Supply Voltage (AC): 300V; Length: 28mm; Pitch: 3.5mm; Depth: 7.29mm; ComponentLink1URL: http://components.arrow.com/part/dataview/0323_07191186?src-supplier=Arrow+Europe; ComponentLink1Description: http://components.arrow.com/part/dataview/0323_07191186?src-supplier=Arrow+Europe; ComponentLink2URL: http://components.arrow.com/part/dataview/42878979S8737925N3303?src-supplier=Arrow; ComponentLink2Description: http://components.arrow.com/part/dataview/42878979S8737925N3303?src-supplier=Arrow; Color: Black; Number of Positions Per Level: 8; Voltage: 300V; Radiation Hardening: No
U5-U8 = DRV8871DDAR: IC BRUSHED DC MOTOR 8SOIC; Manufacturer: Texas Instruments; Interface: PWM; Max Output Current: 3.6A; Fault Protection: Over Temperature; Part Name: DRV8871DDAR; Supplier 1: Digi-Key; Supplier Part Number 1: 296-43024-1-ND; Manufacturer Part Number: DRV8871DDAR; RoHS: Yes; Category: Embedded Processors and Controllers; Stock 1: 10035; Pricing 1: 1=1.87000, 10=1.67900, 25=1.58360, 100=1.26690, 250=1.10852, 500=1.07686, 1000=0.85516 (USD); Min Operating Temperature: -40°C; Max Operating Temperature: 125°C; Packaging: Tape and Reel; ComponentLink1URL: http://www.ti.com/lit/pdf/slyb165?src-supplier=Digi-Key; ComponentLink1Description: http://www.ti.com/lit/pdf/slyb165?src-supplier=Digi-Key; ComponentLink2URL: http://www.ti.com/lit/ds/symlink/drv8871.pdf?src-supplier=Digi-Key; ComponentLink2Description: http://www.ti.com/lit/ds/symlink/drv8871.pdf?src-supplier=Digi-Key; Mount: Surface Mount; Lead Free: Lead Free

## Nets that join several sheets
+3.3V: Microcontroller (14 pins), Encoders (C11.2 U2.2), Power (C10.2 DS2.1 U3.2)
+5V: Encoders (6 pins), Power (C8.2 DS1.1 U4.2)
+VIN: Power (5 pins), Motors (12 pins)
GND: Microcontroller (18 pins), Encoders (8 pins), Power (9 pins), Motors (24 pins)
ENC0: Microcontroller (U1.32), Encoders (U2.1)
ENC1: Microcontroller (U1.31), Encoders (U2.3)
ENC2: Microcontroller (U1.30), Encoders (U2.4)
ENC3: Microcontroller (U1.29), Encoders (U2.5)
ENC4: Microcontroller (U1.23), Encoders (U2.6)
ENC5: Microcontroller (U1.22), Encoders (U2.7)
ENC6: Microcontroller (U1.21), Encoders (U2.8)
ENC7: Microcontroller (U1.18), Encoders (U2.9)
M0_IN1: Microcontroller (U1.50), Motors (U5.3)
M0_IN2: Microcontroller (U1.51), Motors (U5.2)
M1_IN1: Microcontroller (U1.52), Motors (U6.3)
M1_IN2: Microcontroller (U1.53), Motors (U6.2)
M2_IN1: Microcontroller (U1.63), Motors (U7.3)
M2_IN2: Microcontroller (U1.64), Motors (U7.2)
M3_IN1: Microcontroller (U1.2), Motors (U8.3)
M3_IN2: Microcontroller (U1.3), Motors (U8.2)
OE: Microcontroller (U1.17), Encoders (R3.2 U2.10)